# EasyEDA Pro project 01_立创eda专业版_esp32语音助手-自制版_2024-07-09.epro, schematic Schematic1_2

## Sheets
1 esp32_mini: Create Date: 2024-06-28; Page Name: esp32_mini; Project Name: esp32语音助手-自制版; Schematic Name: Schematic1_1; Update Date: 2024-07-01; Company: 嘉立创EDA; Page Size: A4; Version: V1.0
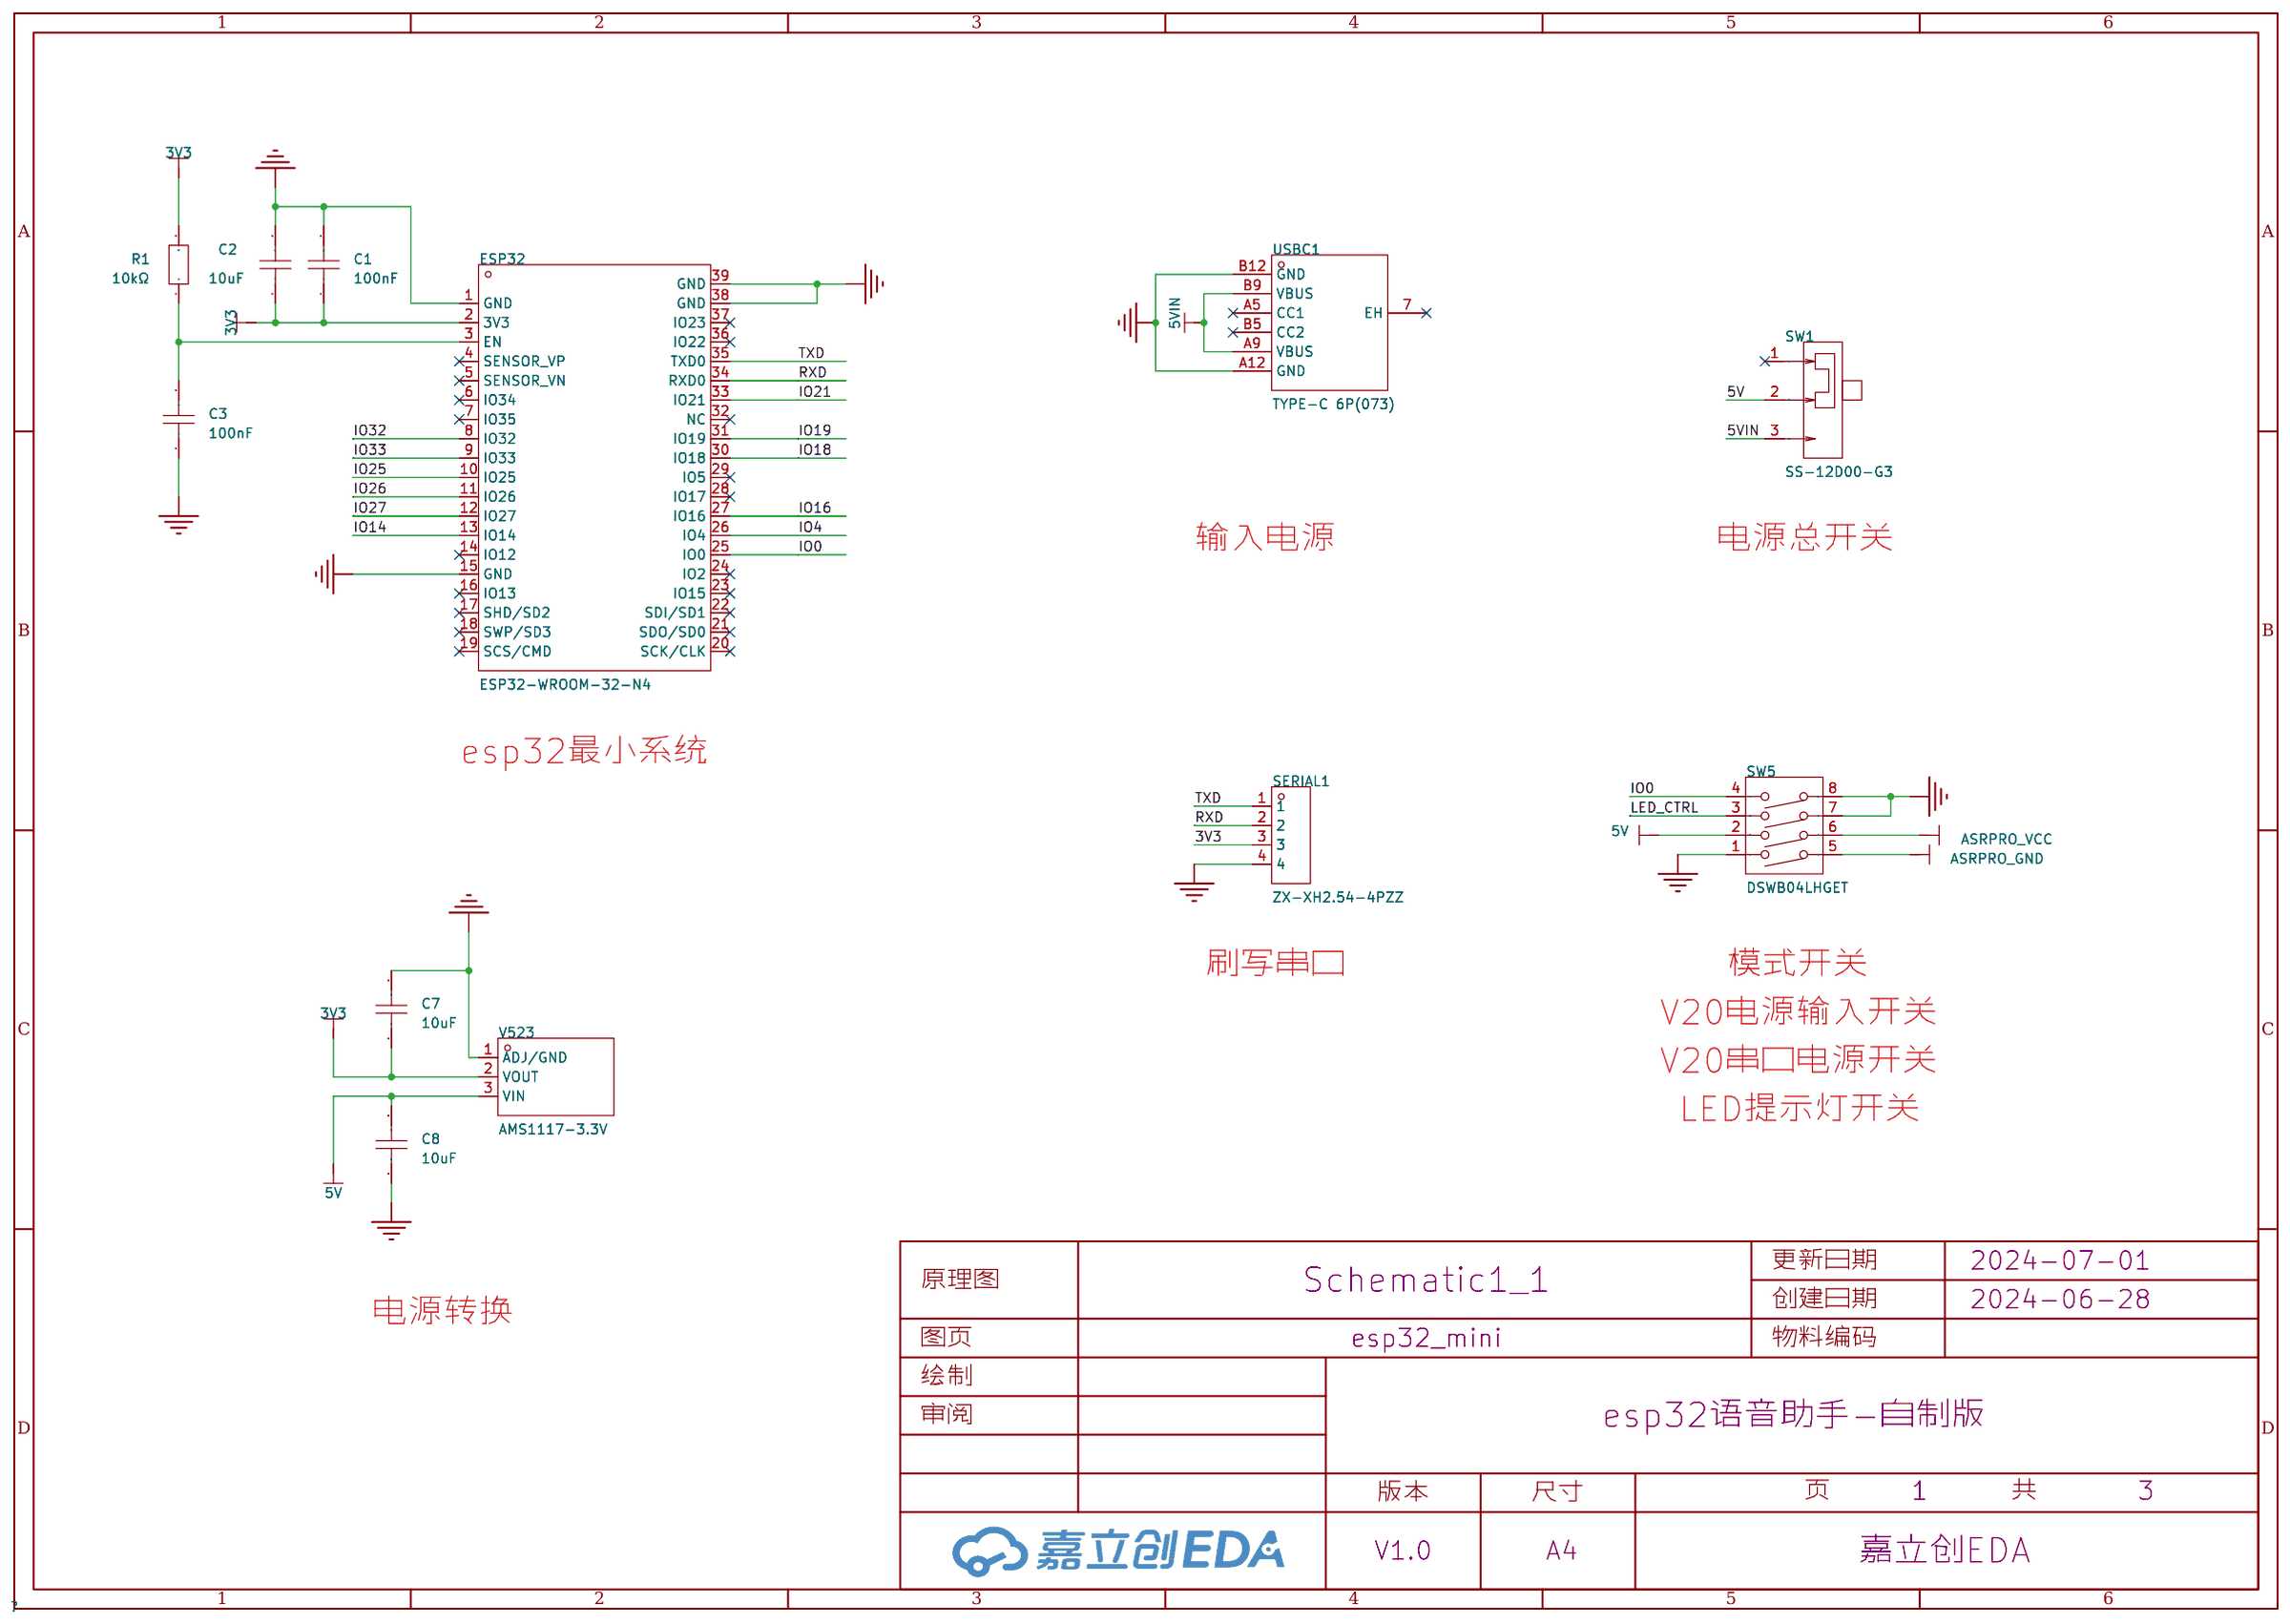
[diagram p6: esp32_mini]
2 twen: Page Name: twen
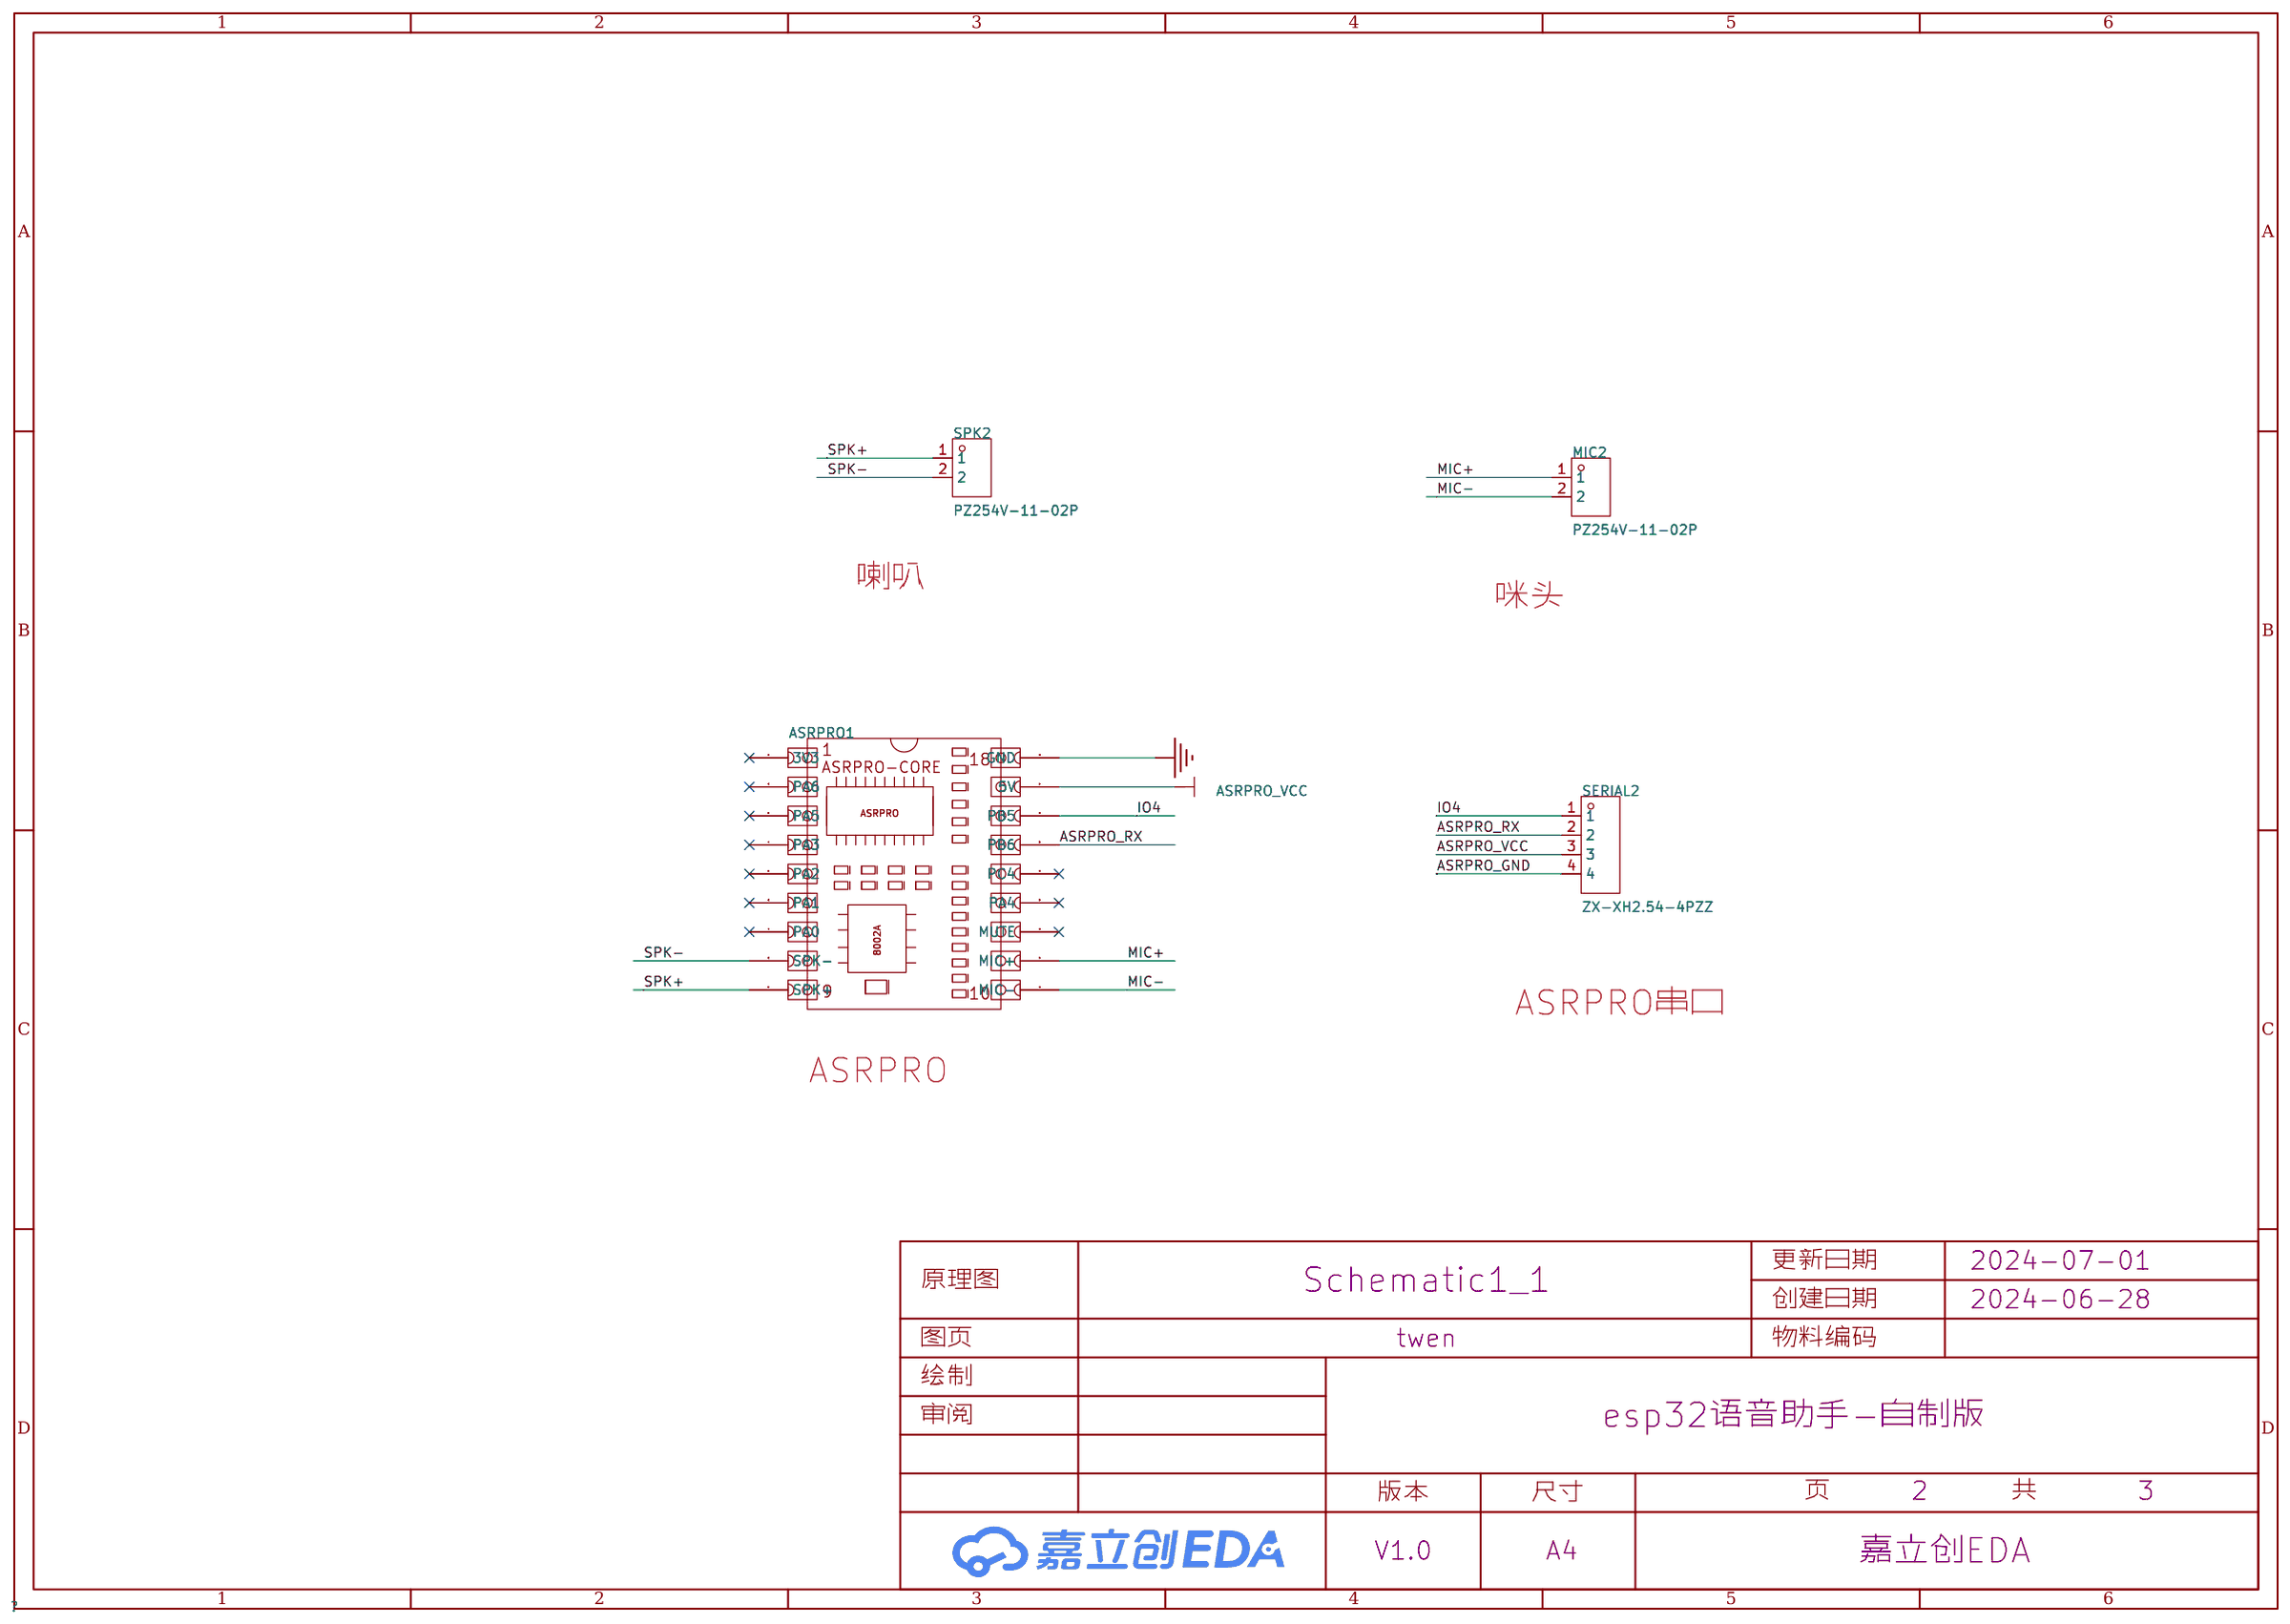
[diagram p7: twen]
3 inandout: Page Name: inandout
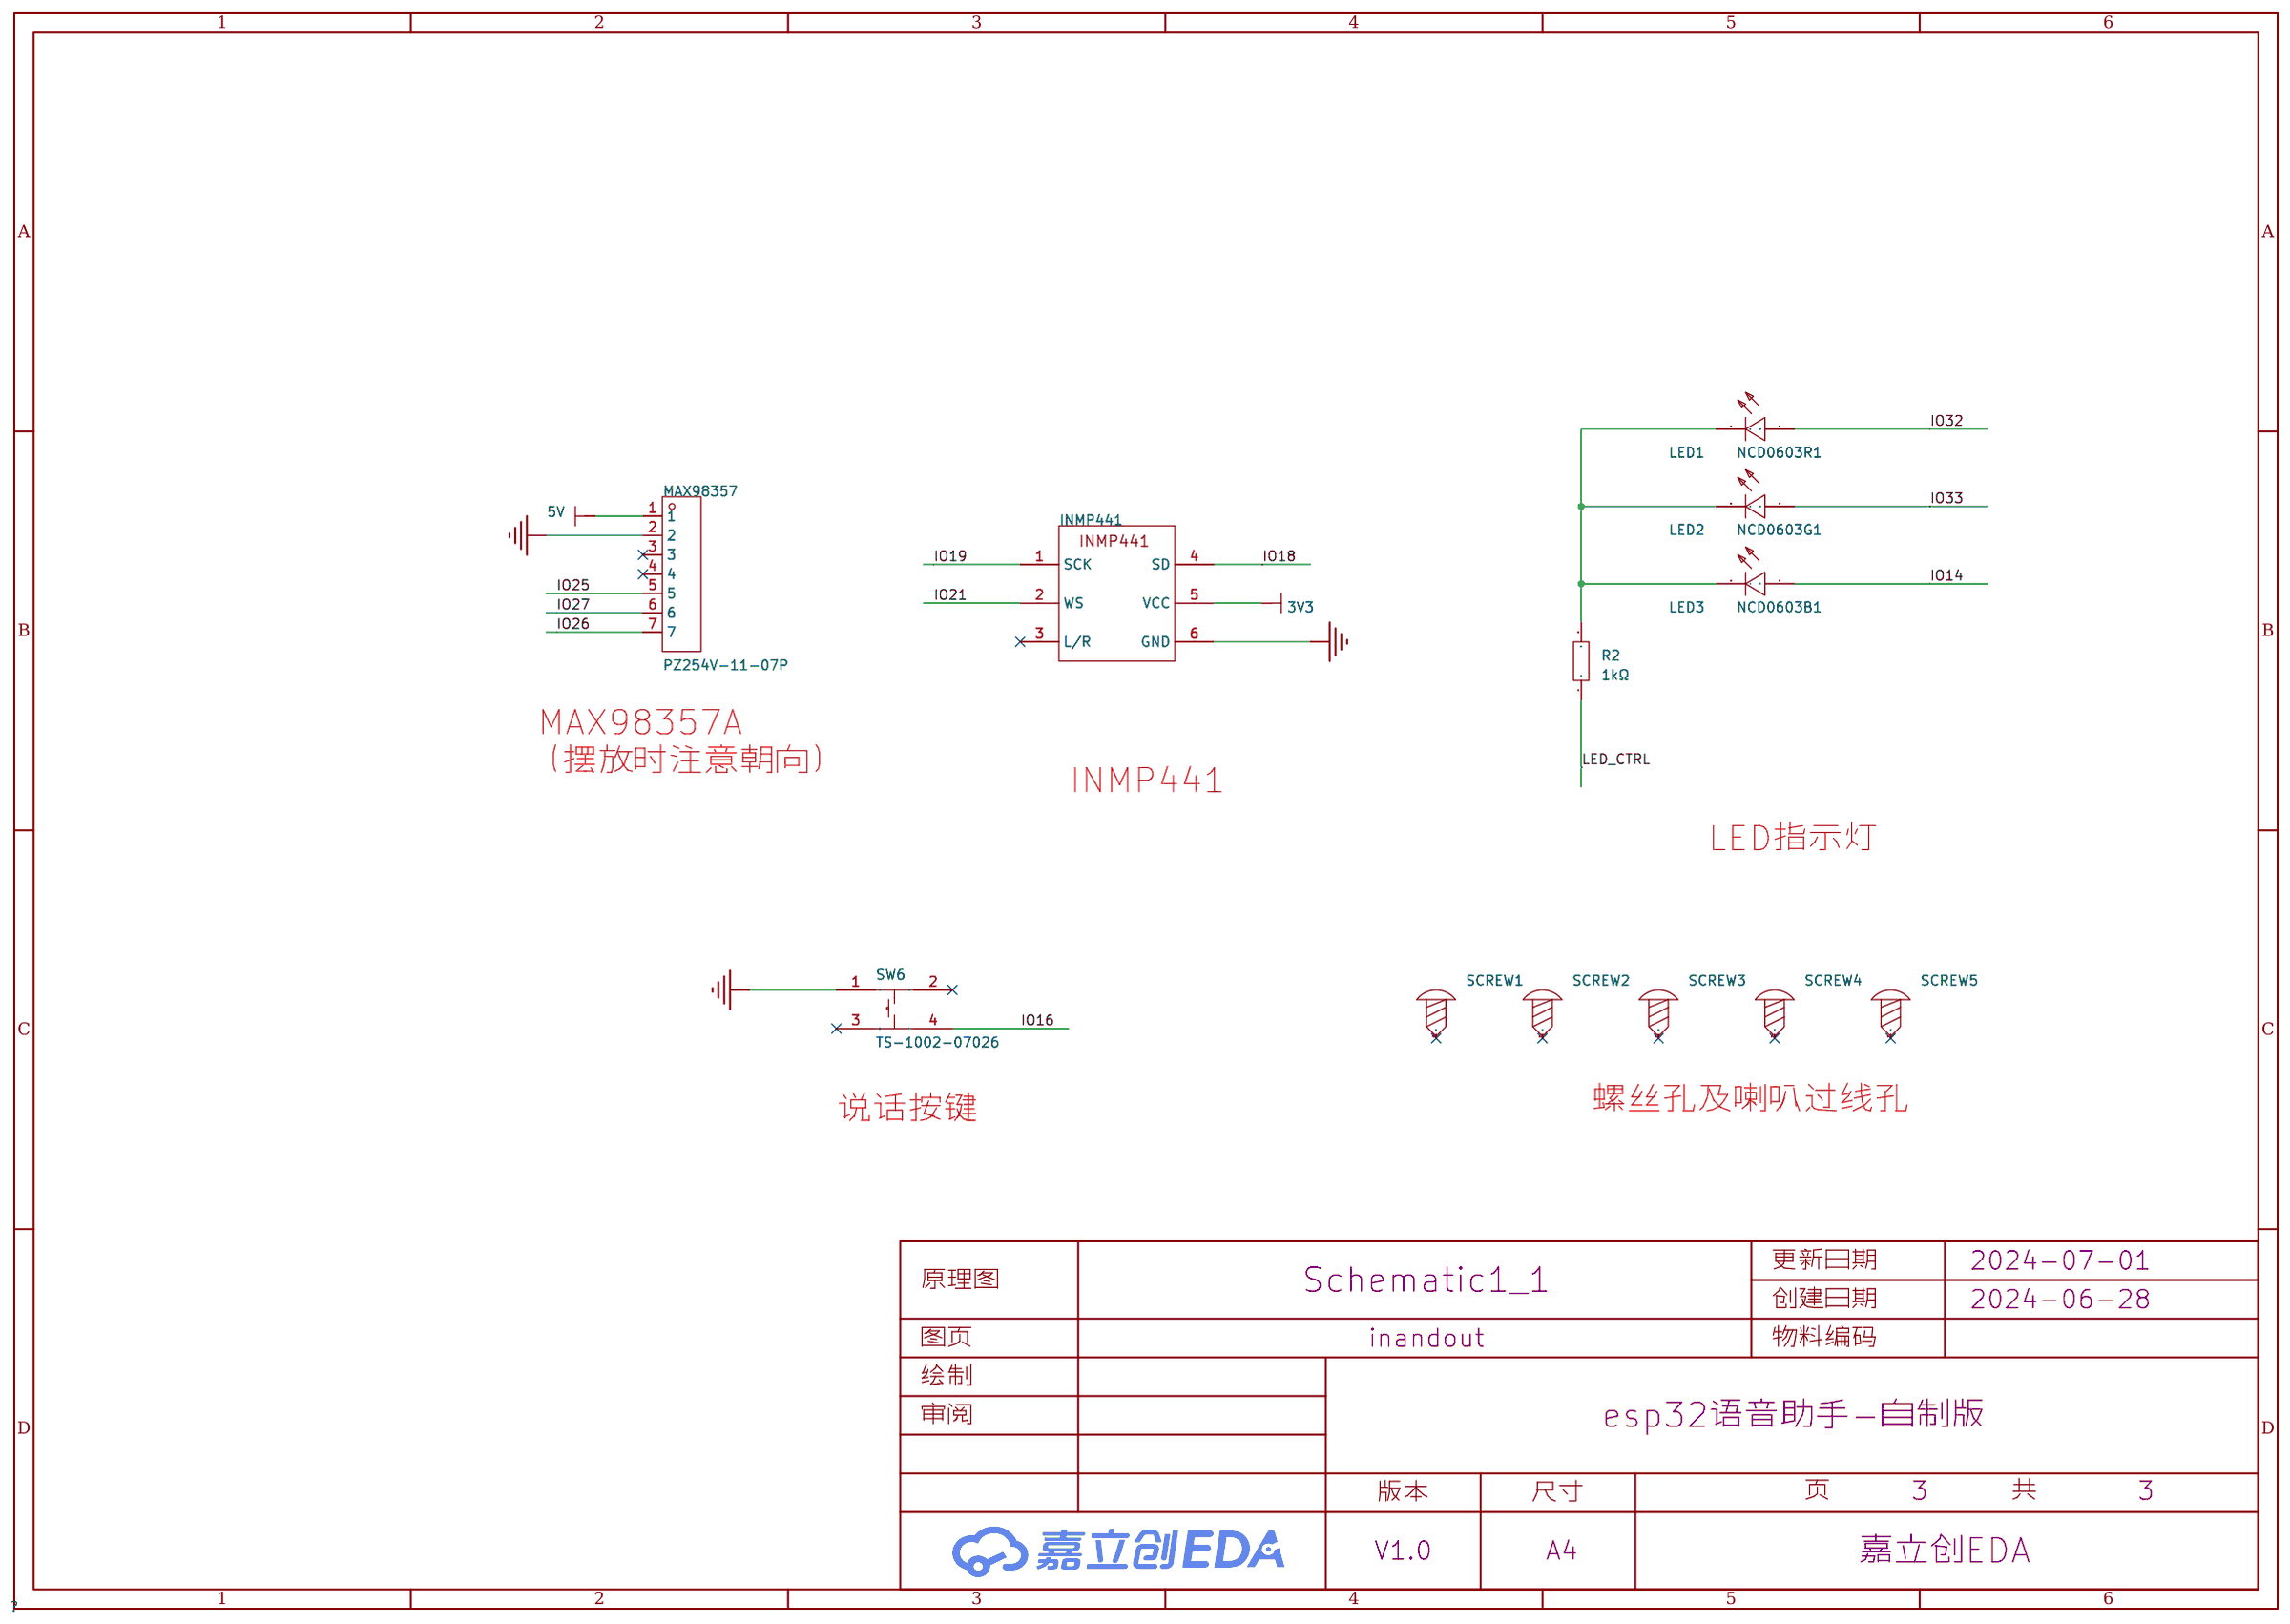
[diagram p8: inandout]

## Parts
sheet esp32_mini
C1  100nF  [C0603]
C2  10uF  [C0603]
C3  100nF  [C0603]
C7  10uF  [C0603]
C8  10uF  [C0603]
ESP32  ESP32-WROOM-32-N4  [WIFIM-SMD_ESP32-WROOM-32-N4]
R1  10kΩ  [R0603]
SERIAL1  ZX-XH2.54-4PZZ  [CONN-TH_4P-P2.50_4PIN]
SW1  SS-12D00-G3  [SW-TH_SS-12D00-G3]
SW5  DSWB04LHGET  [SW-TH_DSWB04LHGET]
USBC1  TYPE-C 6P(073)  [TYPE-C-SMD_TYPE-C-6P]
V523  AMS1117-3.3V  [SOT-89-3_L4.5-W2.5-P1.50-LS4.2-BR]
sheet inandout
INMP441  -  [INMP441]
LED1  NCD0603R1  [LED0603-RD_RED]
LED2  NCD0603G1  [LED0603-RD]
LED3  NCD0603B1  [LED0603-RD]
MAX98357  PZ254V-11-07P  [HDR-TH_7P-P2.54-V-M]
R2  1kΩ  [R0603]
SCREW1  -  [M3螺丝]
SCREW2  -  [M3螺丝]
SCREW3  -  [M3螺丝]
SCREW4  -  [M3螺丝]
SCREW5  -  [M3螺丝]
SW6  TS-1002-07026  [SW-TH_4P-L6.0-W6.0-P4.50-LS6.5]
sheet twen
ASRPRO1  -  [ASRPRO-CORE]
MIC2  PZ254V-11-02P  [HDR-TH_2P-P2.54-V-M]
SERIAL2  ZX-XH2.54-4PZZ  [CONN-TH_4P-P2.50_4PIN]
SPK2  PZ254V-11-02P  [HDR-TH_2P-P2.54-V-M]

## Library data of the parts
C1 C3 = CC0603KRX7R9BB104: 容值:100nF;精度:±10%;额定电压:50V;材质(温度系数):X7R;; LCSC Part Name: 100nF ±10% 50V; Supplier Part: C14663; Manufacturer: YAGEO(国巨); Supplier Footprint: 0603; JLCPCB Part Class: 基础库; Datasheet: https://atta.szlcsc.com/upload/public/pdf/source/20180910/C282072_33301C7F631E79921B82A8DAC6BCC5B3.pdf; Supplier: LCSC; Tolerance: ±10%; Voltage Rated: 50V; Temperature Coefficient: X7R
C2 = CL10A106MA8NRNC: 容值:10uF;精度:±20%;额定电压:25V;材质(温度系数):X5R;; LCSC Part Name: 10uF ±20% 25V; Supplier Part: C96446; Manufacturer: SAMSUNG(三星); Supplier Footprint: 0603; JLCPCB Part Class: 基础库; Datasheet: https://atta.szlcsc.com/upload/public/pdf/source/20160218/1457707763339.pdf; Supplier: LCSC; Tolerance: ±20%; Voltage Rated: 25V; Temperature Coefficient: X5R
C7 C8 = CL10A106KP8NNNC: 容值:10uF;精度:±10%;额定电压:10V;材质(温度系数):X5R;; LCSC Part Name: 10uF ±10% 10V; Supplier Part: C19702; Manufacturer: SAMSUNG(三星); Supplier Footprint: 0603; JLCPCB Part Class: 基础库; Datasheet: https://atta.szlcsc.com/upload/public/pdf/source/20160218/1457707763339.pdf; Supplier: LCSC; Tolerance: ±10%; Voltage Rated: 10V; Temperature Coefficient: X5R
ESP32 = ESP32-WROOM-32-N4: WiFi+蓝牙4.2+双核CPU,ESP32; LCSC Part Name: WiFi+蓝牙4.2+双核CPU模块; Supplier Part: C82899; Manufacturer: ESPRESSIF(乐鑫); Supplier Footprint: SMD,18x25.5mm; JLCPCB Part Class: 扩展库; Datasheet: https://atta.szlcsc.com/upload/public/pdf/source/20210719/C82899_2D52724B6FAFABC419BCF308C5944296.pdf; Supplier: LCSC
R1 = FRC0603J103TS: 电阻类型:厚膜电阻;阻值:10kΩ;精度:±5%;功率:100mW;最大工作电压:75V;温度系数:±100ppm/℃;; LCSC Part Name: 10kΩ ±5% 100mW 厚膜电阻; Supplier Part: C2930027; Manufacturer: FOJAN(富捷); Supplier Footprint: 0603; JLCPCB Part Class: 扩展库; Datasheet: https://atta.szlcsc.com/upload/public/pdf/source/20211221/925EC7D7225764EE0046F22065062C87.pdf; Supplier: LCSC; Type: 厚膜电阻; Tolerance: ±5%; Power(Watts): 100mW; Overload Voltage (Max): 75V; Temperature Coefficient: ±100ppm/℃; Operating Temperature Range: -55℃~+155℃
SERIAL1 SERIAL2 = ZX-XH2.54-4PZZ: 插针结构:1x4P;间距:2.54mm;安装方式:直插;参考系列:XH;总PIN数:4P;排数:1;每排PIN数:4;行距:-;额定电流:3A;触头材质:黄铜;触头镀层:锡;工作温度范围:-25℃~+85℃;; Supplier Part: C7429634; Manufacturer: Megastar(兆星); Supplier Footprint: 插件,P=2.54mm; JLCPCB Part Class: 扩展库; Datasheet: https://atta.szlcsc.com/upload/public/pdf/source/20230619/B529A2163E0159A644AB3383D208FB03.pdf; Supplier: LCSC; Pins Structure: 1x4P; Pitch: 2.54mm; Mounting Style: 直插; Reference Series: XH; Number of Pins: 4P; Number of Rows: 1; Number of PINs Per Row: 4; Current Rating (Max): 3A; Contact Material: 黄铜; Contact Plating: 锡; Operating Temperature Range: -25℃~+85℃
SW1 = SS-12D00-G3: Supplier Part: C22355741; Manufacturer: SOFNG(硕方); Supplier Footprint: 插件-3P,8.8x3.9mm; Datasheet: https://atta.szlcsc.com/upload/public/pdf/source/20240529/1037A069FE9BBCECE56007AB916D4384.pdf; Supplier: LCSC
SW5 = DSWB04LHGET: 类型:平拨,凸起式;电路结构:单刀单掷;开关位数:4位;使用寿命:-;颜色:红色;; LCSC Part Name: 间距2.54mm 平拨,凸起式 4位拨码开关; Supplier Part: C99418; Manufacturer: YE; Supplier Footprint: 插件; JLCPCB Part Class: 扩展库; Datasheet: https://atta.szlcsc.com/upload/public/pdf/source/20220830/02827E67A8727938D957A3CE4C86C92D.pdf; Supplier: LCSC; Type: 平拨,凸起式; Circuit: 单刀单掷; Number of Positions: 4位; Lead Pitch: 2.54mm; Color: 红色
USBC1 = TYPE-C 6P(073): 连接器类型:Type-C;标准:-;公母:母;端口数量:1;触点数量:6P;安装方式:卧贴;额定电流 - 电源:5A;工作温度范围:-25℃~+85℃;; LCSC Part Name: Type-C 母 卧贴; Supplier Part: C668623; Manufacturer: SHOU HAN(首韩); Supplier Footprint: SMD; JLCPCB Part Class: 扩展库; Datasheet: https://atta.szlcsc.com/upload/public/pdf/source/20200618/C668623_A4B260DED7AC1949BAC6AE39E9F4CD80.pdf; Supplier: LCSC; Connector Type: Type-C; Gender: 母; Number of Ports: 1; Number of Contacts: 6P; Mounting Style: 卧贴; Current Rating - Power (Max): 5A; Operating Temperature Range: -25℃~+85℃
V523 = AMS1117-3.3V_C5120796: 输出类型:固定;最大输入电压:18V;输出电压:3.3V;最大输出电流:1A;输出极性:正极;; LCSC Part Name: 输入18V 输出3.3V 1A; Supplier Part: C5120796; Manufacturer: MSKSEMI(美森科); Supplier Footprint: SOT-89; JLCPCB Part Class: 扩展库; Datasheet: https://atta.szlcsc.com/upload/public/pdf/source/20231123/6117526697EB8BF6175FDEEBA0877266.pdf; Supplier: LCSC; Output Type: 固定; Maximum Input Voltage: 18V; Output Voltage: 3.3V; MAX Output Current: 1A; Dropout Voltage: 1.4V@(1A); standby current: 12mA; Operating Temperature: 0℃~+125℃; Output Polarity: 正极; Number of Outputs: 1
INMP441 = inmp441
LED1 = NCD0603R1_C84263: 灯头类型:-;发光颜色:红色;正向电压(VF):1.6V~2.6V;功率:65mW;正向电流:20mA;主波长:615nm~630nm;二极管配置:独立二极管;透镜颜色:无色透明透镜;色温:-;发光强度:80mcd~220mcd;发光角度:130°;载带方式:-;工作温度:-30℃~+85℃;; Supplier Part: C84263; Manufacturer: 国星光电; Supplier Footprint: 0603; JLCPCB Part Class: 扩展库; Datasheet: https://atta.szlcsc.com/upload/public/pdf/source/20200820/C84263_DABC6A75E58F576973B407FDBA283D60.pdf; Supplier: LCSC; Emitted Color: 红色; Forward Voltage (VF): 1.6V~2.6V; Power Dissipation: 65mW; Forward Current: 20mA; Dominant Wavelength: 615nm~630nm; Diode Configuration: 独立二极管; Lens Color: 无色透明透镜; Luminous Intensity: 80mcd~220mcd; Viewing Angle: 130°; Operating Temperature: -30℃~+85℃
LED2 = NCD0603G1: 发光颜色:翠绿色;正向电压(VF):2.6V~3.6V;功率:72mW;正向电流:10mA;主波长:515nm~530nm;透镜颜色:无色透明透镜;发光强度:330mcd~900mcd;发光角度:130°;工作温度:-30℃~+85℃;; Supplier Part: C84267; Manufacturer: 国星光电; Supplier Footprint: 0603; JLCPCB Part Class: 扩展库; Datasheet: https://atta.szlcsc.com/upload/public/pdf/source/20200820/C84267_04BA7703640BAC111D09F5EFB971FBF3.pdf; Supplier: LCSC; Emitted Color: 翠绿色; Forward Voltage (VF): 2.6V~3.6V; Power Dissipation: 72mW; Forward Current: 10mA; Dominant Wavelength: 515nm~530nm; Lens Color: 无色透明透镜; Luminous Intensity: 330mcd~900mcd; Viewing Angle: 130°; Operating Temperature: -30℃~+85℃
LED3 = NCD0603B1: 发光颜色:蓝色;正向电压(VF):2.6V~3.6V;功率:72mW;正向电流:10mA;主波长:463nm~475nm;透镜颜色:无色透明透镜;发光强度:80mcd~220mcd;发光角度:130°;工作温度:-30℃~+85℃;; Supplier Part: C84266; Manufacturer: 国星光电; Supplier Footprint: 0603; JLCPCB Part Class: 扩展库; Datasheet: https://atta.szlcsc.com/upload/public/pdf/source/20200820/C84266_6A3CDBEFA72C6CAD68EDA53474ADAE6C.pdf; Supplier: LCSC; Emitted Color: 蓝色; Forward Voltage (VF): 2.6V~3.6V; Power Dissipation: 72mW; Forward Current: 10mA; Dominant Wavelength: 463nm~475nm; Lens Color: 无色透明透镜; Luminous Intensity: 80mcd~220mcd; Viewing Angle: 130°; Operating Temperature: -30℃~+85℃
MAX98357 = PZ254V-11-07P: 插针结构:1x7P;间距:2.54mm;行距:-;圆针/方针:方针;安装类型:直插;排数:单排;总PIN位数:7P;额定电流:-;额定电压:-;配合针长度:6mm;塑高:2.5mm;端接针长度:3mm;触头材质:黄铜;触头镀层:-;工作温度范围:-40℃~+105℃;颜色:黑色;; LCSC Part Name: 间距:2.54mm 1x7P 直插 方针; Supplier Part: C492406; Manufacturer: XFCN(兴飞); Supplier Footprint: 插件,P=2.54mm; JLCPCB Part Class: 扩展库; Datasheet: https://atta.szlcsc.com/upload/public/pdf/source/20200309/C492406_654C533EE691117E22DD9F76C114C2D9.pdf; Supplier: LCSC; Pin Structure: 1x7P; Pitch: 2.54mm; Circluar Pins/Square Pins: 方针; Mounting Type: 直插; Number of Rows: 单排; Number of Pins: 7P; Length of Mating Pin: 6mm; Insulation Height: 2.5mm; Length of End Connection Pin: 3mm; Contact Material: 黄铜; Operating Temperature Range: -40℃~+105℃; Color: 黑色
R2 = RC0603FR-071KL: 电阻类型:厚膜电阻;阻值:1kΩ;精度:±1%;功率:100mW;最大工作电压:75V;温度系数:±100ppm/℃;; LCSC Part Name: 厚膜电阻 1kΩ ±1% 100mW; Supplier Part: C22548; Manufacturer: YAGEO(国巨); Supplier Footprint: 0603; JLCPCB Part Class: 扩展库; Datasheet: https://atta.szlcsc.com/upload/public/pdf/source/20180316/70C0E2BDAE7FCC62C531A5A58D202EE1.pdf; Supplier: LCSC; Type: 厚膜电阻; Tolerance: ±1%; Power(Watts): 100mW; Overload Voltage (Max): 75V; Temperature Coefficient: ±100ppm/℃; Operating Temperature Range: -55℃~+155℃
SCREW1-SCREW5 = M3螺丝: Supplier Footprint: 插件
SW6 = TS-1002-07026: 电路结构:单刀单掷;按钮形状:圆形按钮;安装方式:直插;开关长度:6mm;开关宽度:6mm;开关高度:7mm;触点电流:50mA;额定电压(DC):12V;带灯:-;机械寿命:-;; LCSC Part Name: 6*6*7mm 直插 轻触开关; Supplier Part: C455095; Manufacturer: XUNPU(讯普); Supplier Footprint: 插件,6x6mm; JLCPCB Part Class: 扩展库; Datasheet: https://atta.szlcsc.com/upload/public/pdf/source/20231108/52BC6409AB52B6746CCC051A15664904.pdf; Supplier: LCSC; Circuit: 单刀单掷; Actuator Style: 圆形按钮; Mounting Style: 直插; Switch Length: 6mm; Switch Width: 6mm; Switch Height: 7mm; Contact Current: 50mA; Voltage Rating (DC): 12V
ASRPRO1 = ASRPRO-CORE 核心板1
MIC2 SPK2 = PZ254V-11-02P: 插针结构:1x2P;间距:2.54mm;行距:-;圆针/方针:方针;安装类型:直插;排数:单排;总PIN位数:2P;额定电流:-;额定电压:-;配合针长度:6mm;塑高:2.5mm;端接针长度:3mm;触头材质:黄铜;触头镀层:-;工作温度范围:-40℃~+105℃;颜色:黑色;; LCSC Part Name: 间距:2.54mm 1x2P 直插 方针; Supplier Part: C492401; Manufacturer: XFCN(兴飞); Supplier Footprint: 插件,P=2.54mm; JLCPCB Part Class: 扩展库; Datasheet: https://atta.szlcsc.com/upload/public/pdf/source/20200309/C492401_A812433581A9B211A7FFA413ADDFF0E5.pdf; Supplier: LCSC; Pin Structure: 1x2P; Pitch: 2.54mm; Circluar Pins/Square Pins: 方针; Mounting Type: 直插; Number of Rows: 单排; Number of Pins: 2P; Length of Mating Pin: 6mm; Insulation Height: 2.5mm; Length of End Connection Pin: 3mm; Contact Material: 黄铜; Operating Temperature Range: -40℃~+105℃; Color: 黑色

## Nets
3V3: C1.1 C2.1 C7.1 ESP32.2(3V3) INMP441.5(VCC) R1.2 SERIAL1.3 V523.2(VOUT)
5V: C8.2 MAX98357.1 SW1.2 SW5.2 V523.3(VIN)
5VIN: SW1.3 USBC1.A9(VBUS) USBC1.B9(VBUS)
GND: ASRPRO1.18(GND) C1.2 C2.2 C3.1 C7.2 C8.1 ESP32.1(GND) ESP32.15(GND) ESP32.38(GND) ESP32.39(GND) INMP441.6(GND) MAX98357.2 SERIAL1.4 SW5.1 SW5.7 SW5.8 SW6.1 USBC1.A12(GND) USBC1.B12(GND) V523.1(ADJ/GND)
ASRPRO_GND: SERIAL2.4 SW5.5
ASRPRO_RX: ASRPRO1.15(PB6) SERIAL2.2
ASRPRO_VCC: ASRPRO1.17(5V) SERIAL2.3 SW5.6
IO0: ESP32.25(IO0) SW5.4
IO4: ASRPRO1.16(PB5) ESP32.26(IO4) SERIAL2.1
IO14: ESP32.13(IO14) LED3.2(+)
IO16: ESP32.27(IO16) SW6.4
IO18: ESP32.30(IO18) INMP441.4(SD)
IO19: ESP32.31(IO19) INMP441.1(SCK)
IO21: ESP32.33(IO21) INMP441.2(WS)
IO25: ESP32.10(IO25) MAX98357.5
IO26: ESP32.11(IO26) MAX98357.7
IO27: ESP32.12(IO27) MAX98357.6
IO32: ESP32.8(IO32) LED1.2(A)
IO33: ESP32.9(IO33) LED2.2(A)
LED_CTRL: R2.1 SW5.3
MIC+: ASRPRO1.11(MIC+) MIC2.1
MIC-: ASRPRO1.10(MIC-) MIC2.2
RXD: ESP32.34(RXD0) SERIAL1.2
SPK+: ASRPRO1.9(SPK+) SPK2.1
SPK-: ASRPRO1.8(SPK-) SPK2.2
TXD: ESP32.35(TXD0) SERIAL1.1
$1N784: C3.2 ESP32.3(EN) R1.1
$3N1069: LED1.1(K) LED2.1(K) LED3.1(-) R2.2

Not connected (* = marked no-connect by the designer): ASRPRO1 1(3V3)* 2(PA6)* 3(PA5)* 4(PA3)* 5(PA2)* 6(PA1)* 7(PA0)* 12(MUTE)* 13(PA4)* 14(PC4)*; ESP32 4(SENSOR_VP)* 5(SENSOR_VN)* 6(IO34)* 7(IO35)* 14(IO12)* 16(IO13)* 17(SHD/SD2)* 18(SWP/SD3)* 19(SCS/CMD)* 20(SCK/CLK)* 21(SDO/SD0)* 22(SDI/SD1)* 23(IO15)* 24(IO2)* 28(IO17)* 29(IO5)* 32(NC)* 36(IO22)* 37(IO23)*; INMP441 3(L/R)*; MAX98357 3* 4*; SCREW1 1*; SCREW2 1*; SCREW3 1*; SCREW4 1*; SCREW5 1*; SW1 1*; SW6 2* 3*; USBC1 7(EH)* A5(CC1)* B5(CC2)*

## Notes on the sheets
sheet 1
- 输入电源
- 电源总开关
- esp32最小系统
- 刷写串口
- 模式开关
- V20电源输入开关
- V20串口电源开关
- LED提示灯开关
- 电源转换
sheet 2
- 喇叭
- 咪头
- ASRPRO串口
- ASRPRO
sheet 3
- MAX98357A
  （摆放时注意朝向）
- INMP441
- LED指示灯
- 螺丝孔及喇叭过线孔
- 说话按键
